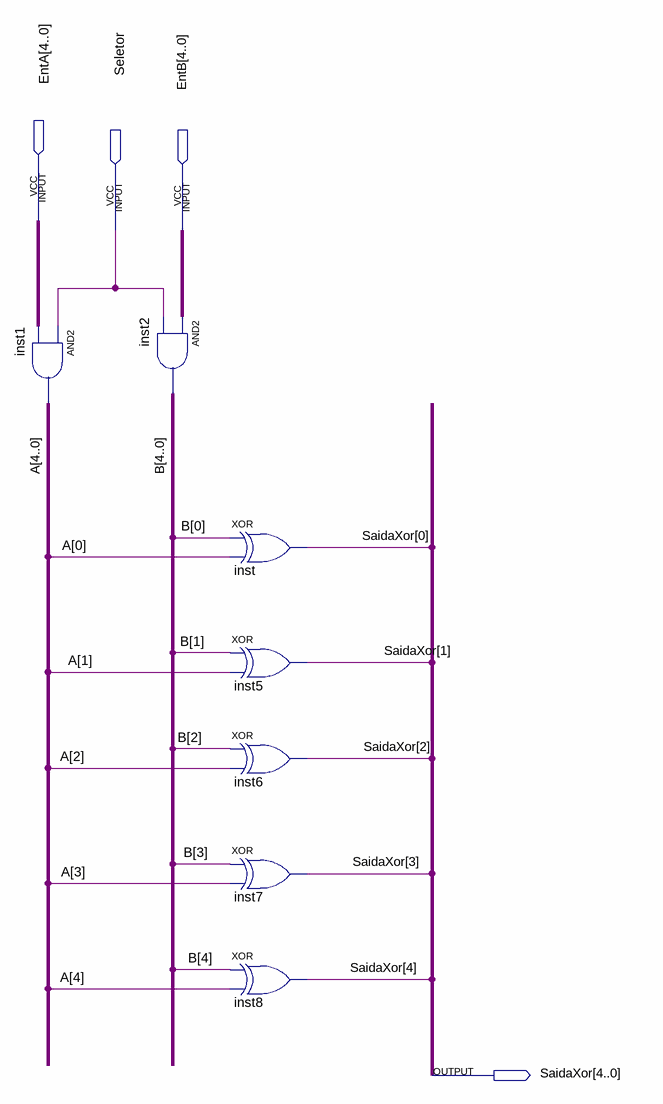
[diagram p0: schematic sheet]
// Quartus schematic PXor.bdf as structural Verilog: 7 symbols, 4 pins
module PXor (
  input  [4:0] EntA,
  input  Seletor,
  input  [4:0] EntB,
  output [4:0] SaidaXor
);

  wire [4:0] A, B;

  assign A = {5{Seletor}} & EntA;  // AND2 inst1, 5 bits wide
  assign B = EntB & {5{Seletor}};  // AND2 inst2, 5 bits wide
  xor inst (SaidaXor[0], B[0], A[0]);
  xor inst5 (SaidaXor[1], B[1], A[1]);
  xor inst6 (SaidaXor[2], B[2], A[2]);
  xor inst7 (SaidaXor[3], B[3], A[3]);
  xor inst8 (SaidaXor[4], B[4], A[4]);
endmodule
